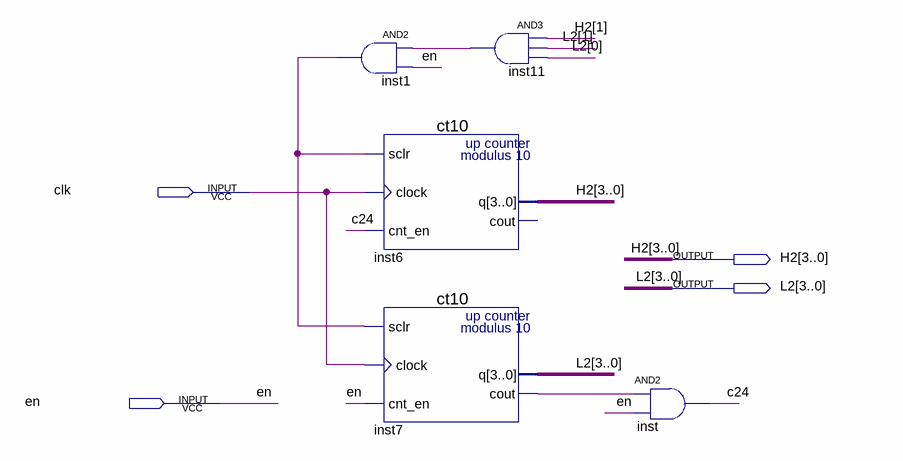
[diagram p0: schematic sheet]
// Quartus schematic block24.bdf as structural Verilog: 5 symbols, 4 pins
module block24 (
  input  clk,
  input  en,
  output [3:0] H2,
  output [3:0] L2
);

  wire c24, inst1_out, inst7_cout, inst11_out;

  and inst1 (inst1_out, inst11_out, en);
  ct10 inst6 (.sclr(inst1_out), .clock(clk), .cnt_en(c24), .q(H2));  // open: cout
  ct10 inst7 (.sclr(inst1_out), .clock(clk), .cnt_en(en), .q(L2), .cout(inst7_cout));
  and inst11 (inst11_out, H2[1], L2[1], L2[0]);
  and inst (c24, inst7_cout, en);
endmodule
